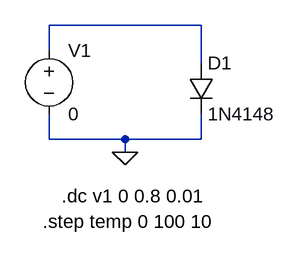
[diagram p0: schematic 02. diodo 1N4148.asc]
02. diodo 1N4148.asc, the LTspice schematic file:
Version 4
SHEET 1 880 680
WIRE 256 96 64 96
WIRE 64 128 64 96
WIRE 256 144 256 96
WIRE 64 240 64 208
WIRE 160 240 64 240
WIRE 256 240 256 208
WIRE 256 240 160 240
WIRE 160 256 160 240
FLAG 160 256 0
SYMBOL voltage 64 112 R0
WINDOW 123 0 0 Left 0
WINDOW 39 0 0 Left 0
SYMATTR InstName V1
SYMATTR Value 0
SYMBOL diode 240 144 R0
SYMATTR InstName D1
SYMATTR Value 1N4148
TEXT 80 312 Left 2 !.dc v1 0 0.8 0.01
TEXT 56 344 Left 2 !.step temp 0 100 10

The netlist it stands for:
* 02. diodo 1N4148.asc
V1 N001 0 0
D1 N001 0 1N4148
.model D D
.lib standard.dio
.dc v1 0 0.8 0.01
.step temp 0 100 10
.backanno
.end